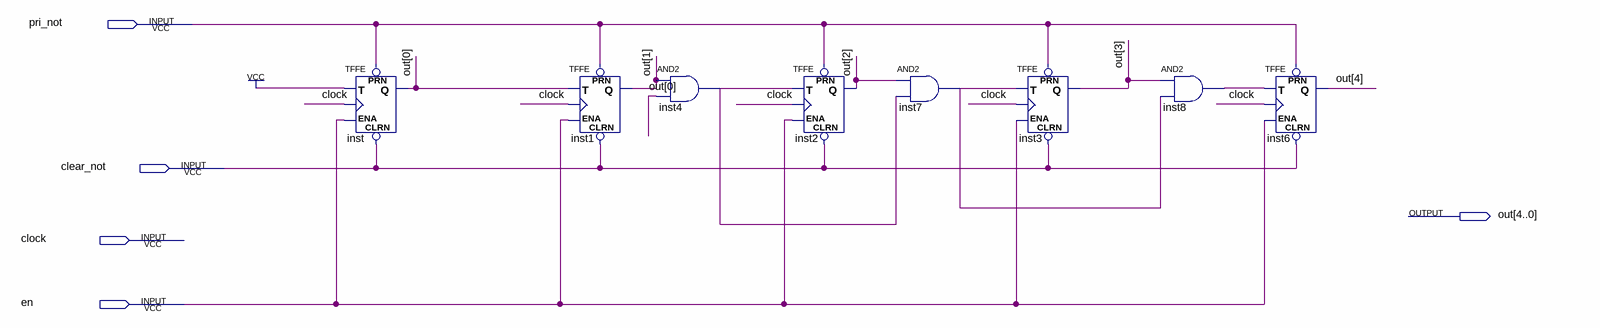
[diagram p0: schematic sheet]
// Quartus schematic ripple_counter_4bit.bdf as structural Verilog: 8 symbols, 5 pins
module ripple_counter_4bit (
  input  pri_not,
  input  clear_not,
  input  clock,
  input  en,
  output [4:0] out
);

  wire inst4_out, inst7_out, inst8_out;

  TFFE inst (.CLRN(clear_not), .T(1'b1), .CLK(clock), .ENA(en), .PRN(pri_not), .Q(out[0]));
  TFFE inst1 (.CLRN(clear_not), .T(out[0]), .CLK(clock), .ENA(en), .PRN(pri_not), .Q(out[1]));
  and inst4 (inst4_out, out[1], out[0]);
  TFFE inst2 (.CLRN(clear_not), .T(inst4_out), .CLK(clock), .ENA(en), .PRN(pri_not), .Q(out[2]));
  and inst7 (inst7_out, out[2], inst4_out);
  TFFE inst3 (.CLRN(clear_not), .T(inst7_out), .CLK(clock), .ENA(en), .PRN(pri_not), .Q(out[3]));
  and inst8 (inst8_out, out[3], inst7_out);
  TFFE inst6 (.CLRN(clear_not), .T(inst8_out), .CLK(clock), .ENA(en), .PRN(pri_not), .Q(out[4]));
endmodule
